# EAGLE board spokepov (EAGLE 6.6.0)
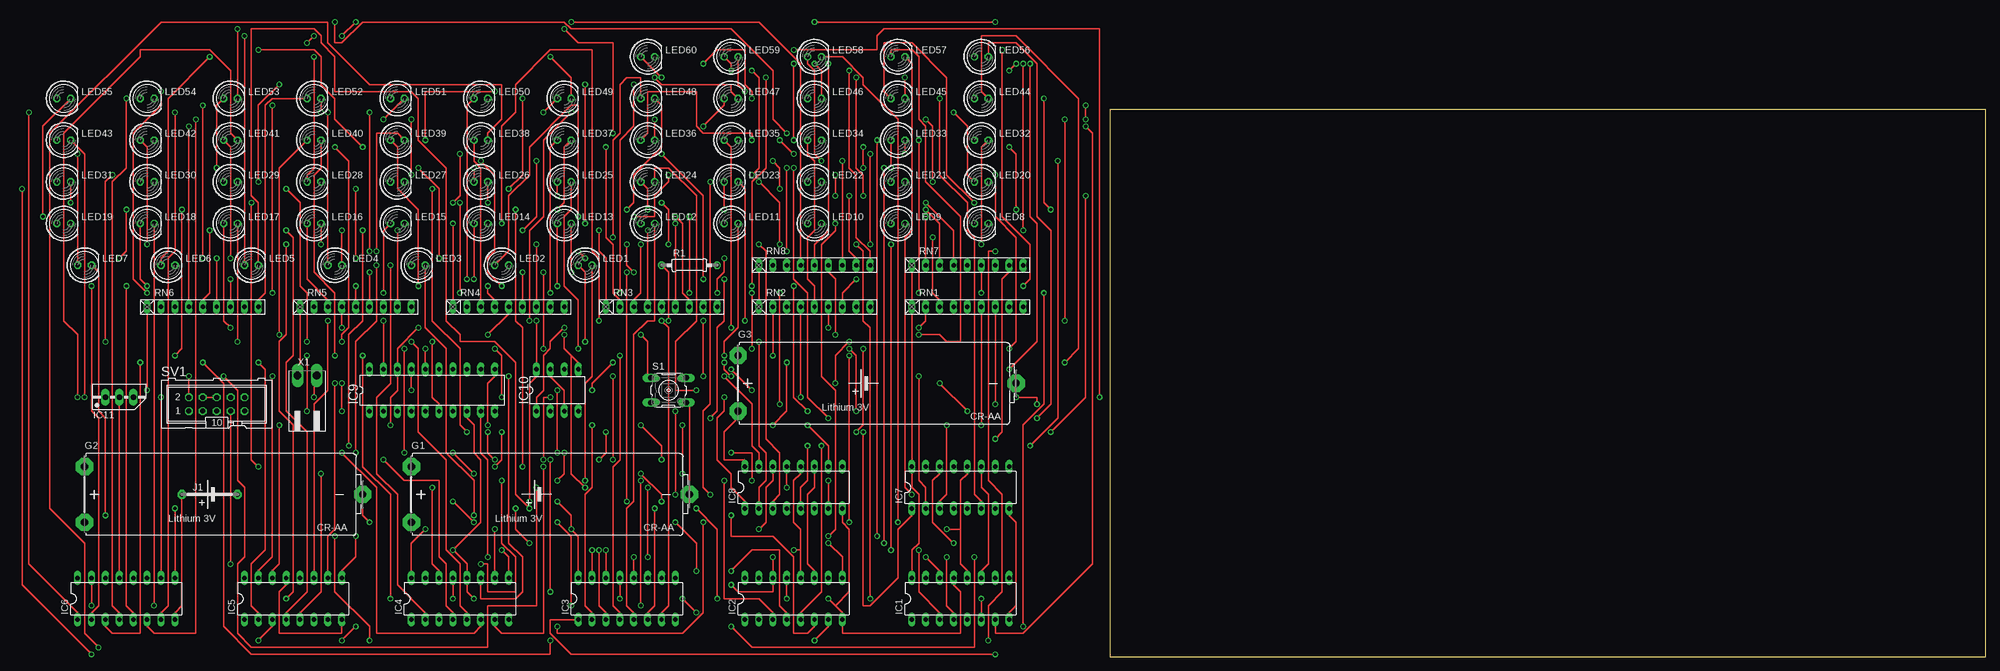
[diagram p1: board, top side]
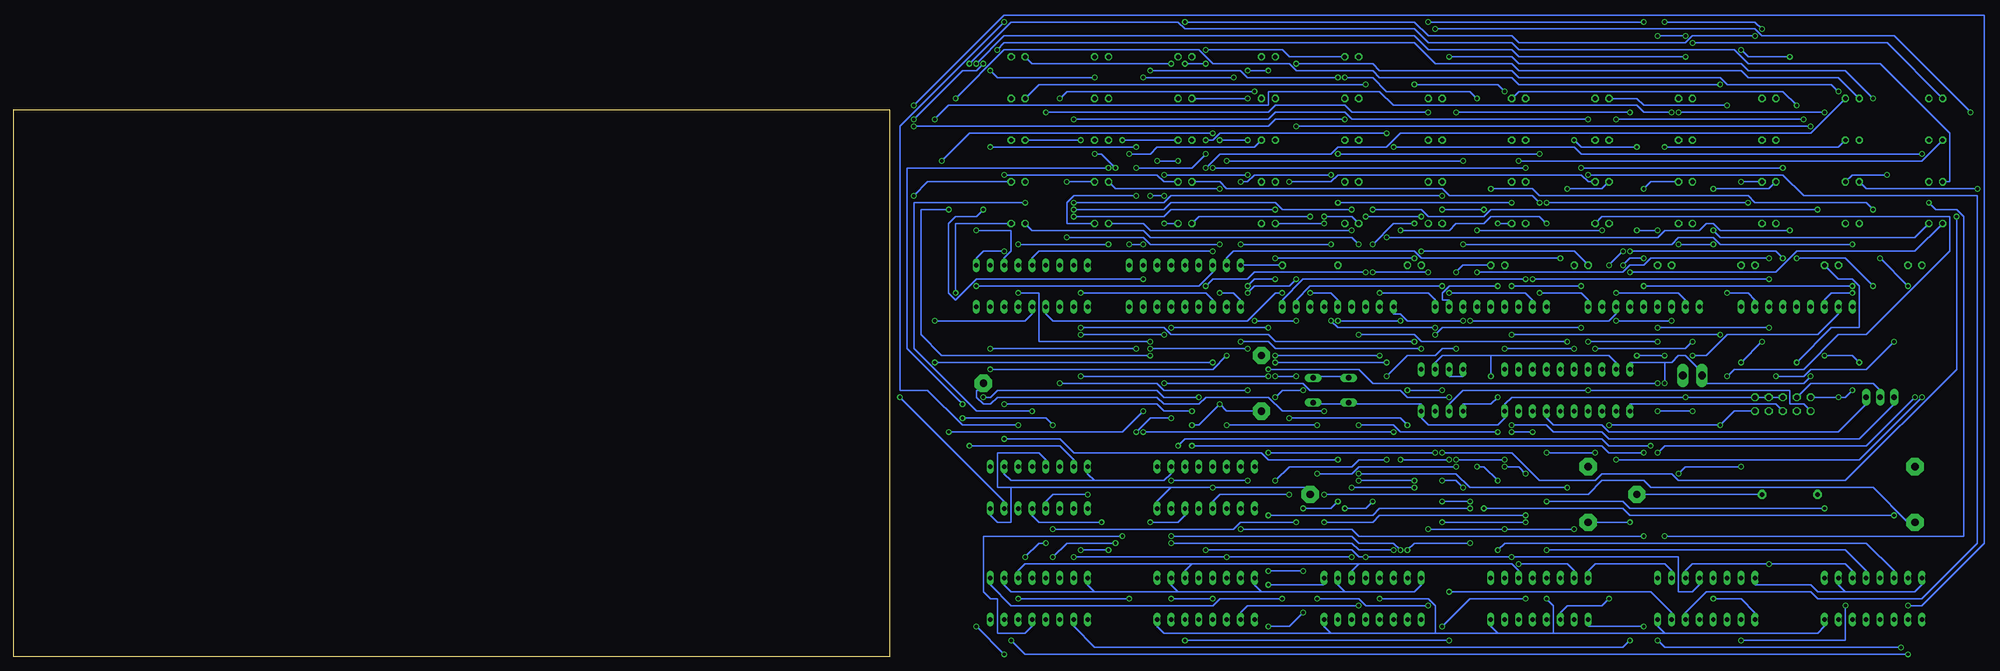
[diagram p2: board, bottom side, seen from below]

Size 160 x 100 mm. Coordinates in mm from the lower left corner, seen from the top.
Outline: 0,0 160,0 160,100 0,100 0,0
Copper layers (1*16): Top 0.035mm / dielectric 1.5mm / Bottom 0.035mm
Design rules "10mils": minimum track width 10mil, minimum drill 24mil, track to track 10mil, track to pad 10mil, pad to pad 10mil, via to via 10mil, smd to smd 10mil, copper to edge 40mil, drill to drill 10mil, minimum pad ring 10mil, minimum via ring 8mil, stop-mask expansion 0mil, vias tented up to drill 0mil, thermal gap 10mil

## Footprints (pad centres in the part's own frame; a part is rotated, then mirrored left to right if it is on the bottom)
CRAA = drill 1.321 pad 3.15 octagon: + -25.4,-5.08; +@1 -25.4,5.08; - 25.4,0
DIL16 = drill 0.813 long: 1 -8.89,-3.81; 2 -6.35,-3.81; 3 -3.81,-3.81; 4 -1.27,-3.81; 5 1.27,-3.81; 6 3.81,-3.81; 7 6.35,-3.81; 8 8.89,-3.81; 9 8.89,3.81; 10 6.35,3.81; 11 3.81,3.81; 12 1.27,3.81; 13 -1.27,3.81; 14 -3.81,3.81; 15 -6.35,3.81; 16 -8.89,3.81
DIL20 = drill 0.813 long: 1 -11.43,-3.81; 2 -8.89,-3.81; 3 -6.35,-3.81; 4 -3.81,-3.81; 5 -1.27,-3.81; 6 1.27,-3.81; 7 3.81,-3.81; 8 6.35,-3.81; 9 8.89,-3.81; 10 11.43,-3.81; 11 11.43,3.81; 12 8.89,3.81; 13 6.35,3.81; 14 3.81,3.81; 15 1.27,3.81; 16 -1.27,3.81; 17 -3.81,3.81; 18 -6.35,3.81; 19 -8.89,3.81; 20 -11.43,3.81
DIL8 = drill 0.813 long: 1 -3.81,-3.81; 2 -1.27,-3.81; 3 1.27,-3.81; 4 3.81,-3.81; 5 3.81,3.81; 6 1.27,3.81; 7 -1.27,3.81; 8 -3.81,3.81
78MXXS = drill 1.016 long: GND 0,-2.54; IN -2.54,-2.54; OUT 2.54,-2.54
10 = drill 0.813 pad 1.6 octagon: 1 -5.08,0; 2 5.08,0
LED5MM = drill 0.813 octagon: A -1.27,0; K 1.27,0
0207/10 = drill 0.813 octagon: 1 -5.08,0; 2 5.08,0
RN-9 = drill 0.813 long: 1 -10.16,0; 2 -7.62,0; 3 -5.08,0; 4 -2.54,0; 5 0,0; 6 2.54,0; 7 5.08,0; 8 7.62,0; 9 10.16,0
B3F-10XX = drill 1.016 long: 1 -3.251,2.261; 2 3.251,2.261; 3 -3.251,-2.261; 4 3.251,-2.261
ML10 = drill 0.914 octagon: 1 -5.08,-1.27; 2 -5.08,1.27; 3 -2.54,-1.27; 4 -2.54,1.27; 5 0,-1.27; 6 0,1.27; 7 2.54,-1.27; 8 2.54,1.27; 9 5.08,-1.27; 10 5.08,1.27
90-2 = drill 1.422 long: 1 -1.75,5.25; 2 1.75,5.25

## Placement (x,y rotation side)
G1  CR-AA  [CRAA]  -102.24,29.68 0 top  (outside the outline)
G2  CR-AA  [CRAA]  -161.93,29.68 0 top  (outside the outline)
G3  CR-AA  [CRAA]  -42.55,50 0 top  (outside the outline)
IC1  74LS595N  [DIL16]  -27.31,10.63 0 top  (outside the outline)
IC2  74LS595N  [DIL16]  -57.79,10.63 0 top  (outside the outline)
IC3  74LS595N  [DIL16]  -88.27,10.63 0 top  (outside the outline)
IC4  74LS595N  [DIL16]  -118.75,10.63 0 top  (outside the outline)
IC5  74LS595N  [DIL16]  -149.23,10.63 0 top  (outside the outline)
IC6  74LS595N  [DIL16]  -179.71,10.63 0 top  (outside the outline)
IC7  74LS595N  [DIL16]  -27.31,30.95 0 top  (outside the outline)
IC8  74LS595N  [DIL16]  -57.79,30.95 0 top  (outside the outline)
IC9  ATTINY2313-20P  [DIL20]  -123.83,48.73 0 top  (outside the outline)
IC10  25LC080P  [DIL8]  -100.97,48.73 0 top  (outside the outline)
IC11  DN6852  [78MXXS]  -180.98,50 0 top  (outside the outline)
J1  J10MM  [10]  -164.47,29.68 0 top  (outside the outline)
LED1  [LED5MM]  -95.89,71.59 0 top  (outside the outline)
LED2  [LED5MM]  -111.13,71.59 0 top  (outside the outline)
LED3  [LED5MM]  -126.37,71.59 0 top  (outside the outline)
LED4  [LED5MM]  -141.61,71.59 0 top  (outside the outline)
LED5  [LED5MM]  -156.85,71.59 0 top  (outside the outline)
LED6  [LED5MM]  -172.09,71.59 0 top  (outside the outline)
LED7  [LED5MM]  -187.33,71.59 0 top  (outside the outline)
LED8  [LED5MM]  -23.5,79.21 0 top  (outside the outline)
LED9  [LED5MM]  -38.74,79.21 0 top  (outside the outline)
LED10  [LED5MM]  -53.98,79.21 0 top  (outside the outline)
LED11  [LED5MM]  -69.22,79.21 0 top  (outside the outline)
LED12  [LED5MM]  -84.46,79.21 0 top  (outside the outline)
LED13  [LED5MM]  -99.7,79.21 0 top  (outside the outline)
LED14  [LED5MM]  -114.94,79.21 0 top  (outside the outline)
LED15  [LED5MM]  -130.18,79.21 0 top  (outside the outline)
LED16  [LED5MM]  -145.42,79.21 0 top  (outside the outline)
LED17  [LED5MM]  -160.66,79.21 0 top  (outside the outline)
LED18  [LED5MM]  -175.9,79.21 0 top  (outside the outline)
LED19  [LED5MM]  -191.14,79.21 0 top  (outside the outline)
LED20  [LED5MM]  -23.5,86.83 0 top  (outside the outline)
LED21  [LED5MM]  -38.74,86.83 0 top  (outside the outline)
LED22  [LED5MM]  -53.98,86.83 0 top  (outside the outline)
LED23  [LED5MM]  -69.22,86.83 0 top  (outside the outline)
LED24  [LED5MM]  -84.46,86.83 0 top  (outside the outline)
LED25  [LED5MM]  -99.7,86.83 0 top  (outside the outline)
LED26  [LED5MM]  -114.94,86.83 0 top  (outside the outline)
LED27  [LED5MM]  -130.18,86.83 0 top  (outside the outline)
LED28  [LED5MM]  -145.42,86.83 0 top  (outside the outline)
LED29  [LED5MM]  -160.66,86.83 0 top  (outside the outline)
LED30  [LED5MM]  -175.9,86.83 0 top  (outside the outline)
LED31  [LED5MM]  -191.14,86.83 0 top  (outside the outline)
LED32  [LED5MM]  -23.5,94.45 0 top  (outside the outline)
LED33  [LED5MM]  -38.74,94.45 0 top  (outside the outline)
LED34  [LED5MM]  -53.98,94.45 0 top  (outside the outline)
LED35  [LED5MM]  -69.22,94.45 0 top  (outside the outline)
LED36  [LED5MM]  -84.46,94.45 0 top  (outside the outline)
LED37  [LED5MM]  -99.7,94.45 0 top  (outside the outline)
LED38  [LED5MM]  -114.94,94.45 0 top  (outside the outline)
LED39  [LED5MM]  -130.18,94.45 0 top  (outside the outline)
LED40  [LED5MM]  -145.42,94.45 0 top  (outside the outline)
LED41  [LED5MM]  -160.66,94.45 0 top  (outside the outline)
LED42  [LED5MM]  -175.9,94.45 0 top  (outside the outline)
LED43  [LED5MM]  -191.14,94.45 0 top  (outside the outline)
LED44  [LED5MM]  -23.5,102.07 0 top  (outside the outline)
LED45  [LED5MM]  -38.74,102.07 0 top  (outside the outline)
LED46  [LED5MM]  -53.98,102.07 0 top  (outside the outline)
LED47  [LED5MM]  -69.22,102.07 0 top  (outside the outline)
LED48  [LED5MM]  -84.46,102.07 0 top  (outside the outline)
LED49  [LED5MM]  -99.7,102.07 0 top  (outside the outline)
LED50  [LED5MM]  -114.94,102.07 0 top  (outside the outline)
LED51  [LED5MM]  -130.18,102.07 0 top  (outside the outline)
LED52  [LED5MM]  -145.42,102.07 0 top  (outside the outline)
LED53  [LED5MM]  -160.66,102.07 0 top  (outside the outline)
LED54  [LED5MM]  -175.9,102.07 0 top  (outside the outline)
LED55  [LED5MM]  -191.14,102.07 0 top  (outside the outline)
LED56  [LED5MM]  -23.5,109.69 0 top  (outside the outline)
LED57  [LED5MM]  -38.74,109.69 0 top  (outside the outline)
LED58  [LED5MM]  -53.98,109.69 0 top  (outside the outline)
LED59  [LED5MM]  -69.22,109.69 0 top  (outside the outline)
LED60  [LED5MM]  -84.46,109.69 0 top  (outside the outline)
R1  [0207/10]  -76.84,71.59 0 top  (outside the outline)
RN1  [RN-9]  -26.04,63.97 0 top  (outside the outline)
RN2  [RN-9]  -53.98,63.97 0 top  (outside the outline)
RN3  [RN-9]  -81.92,63.97 0 top  (outside the outline)
RN4  [RN-9]  -109.86,63.97 0 top  (outside the outline)
RN5  [RN-9]  -137.8,63.97 0 top  (outside the outline)
RN6  [RN-9]  -165.74,63.97 0 top  (outside the outline)
RN7  [RN-9]  -26.04,71.59 0 top  (outside the outline)
RN8  [RN-9]  -53.98,71.59 0 top  (outside the outline)
S1  [B3F-10XX]  -80.65,48.73 0 top  (outside the outline)
SV1  [ML10]  -163.2,46.19 0 top  (outside the outline)
X1  [90-2]  -146.69,46.19 0 top  (outside the outline)

## Tracks (layer width: path | path; a pad name or v marks a point on that pad's centre or on a via)
B_SELECT  (via drill 0.61)
  Top 0.254: -56.52,19.52 -56.52,23.33 -57.79,24.6 -57.79,32.22 -56.52,33.49 IC8.12 | -56.52,19.52 IC2.12 | v-87,18.25 IC3.12 | IC9.9 -114.94,37.3 -113.67,36.03 v-113.67,18.25 | -56.52,19.52 v-57.79,19.52
  Bottom 0.254: IC5.12 -147.96,13.17 -146.69,11.9 -144.15,11.9 -144.15,18.25 v-113.67,18.25 v-87,18.25 -85.73,18.25 -84.46,19.52 v-57.79,19.52
BUTTON_IN  (via drill 0.61)
  Top 0.254: v-123.83,57.62 -123.83,47.46 -122.56,46.19 IC9.6 | v-85.73,58.89 -84.46,57.62 -84.46,51.27 S1.1
  Bottom 0.254: v-123.83,57.62 -97.16,57.62 -95.89,58.89 v-85.73,58.89 | S1.2 -78.11,51.27 -83.19,51.27 S1.1
EE_CS  (via drill 0.61)
  Top 0.254: v-125.1,56.35 IC9.16 | v-112.4,56.35 -111.13,55.08 v-111.13,47.46 | R1.1 -80.65,70.32 v-80.65,61.43 | v-99.7,60.16 -102.24,57.62 -102.24,56.35 -103.51,55.08 -103.51,48.73 -104.78,47.46 IC10.1
  Bottom 0.254: v-112.4,56.35 v-125.1,56.35 | v-111.13,47.46 -109.86,46.19 -104.78,46.19 IC10.1 | v-80.65,61.43 -81.92,60.16 v-99.7,60.16
F_SELECT  (via drill 0.61)
  Top 0.254: -27.31,23.33 -27.31,32.22 -26.04,33.49 IC7.12 | -27.31,23.33 -27.31,16.98 -26.04,15.71 IC1.12 | IC9.8 -117.48,43.65 -116.21,42.38 -116.21,37.3 -114.94,36.03 -114.94,24.6 v-120.02,19.52 -117.48,16.98 IC4.12 -117.48,11.9 v-116.21,10.63 | -27.31,23.33 v-29.85,23.33 | v-74.3,24.6 -74.3,8.09 -78.11,4.28 -100.97,4.28 v-100.97,5.55
  Bottom 0.254: v-120.02,19.52 -174.63,19.52 -178.44,15.71 IC6.12 | v-29.85,23.33 -62.87,23.33 -64.14,24.6 v-74.3,24.6 | v-100.97,5.55 -106.05,10.63 v-116.21,10.63
GND  (via drill 0.61)
  Top 0.254: J1.1 -169.55,9.36 -170.82,8.09 IC6.8 | IC5.13 -150.5,13.17 -151.77,11.9 -151.77,4.28 -140.34,4.28 IC5.8 | v-120.02,10.63 IC4.13 | v-89.54,10.63 IC3.13 | v-59.06,10.63 IC2.13 | -50.17,9.36 -48.9,8.09 IC2.8 -48.9,4.28 -27.31,4.28 -27.31,11.9 -28.58,13.17 IC1.13 | -50.17,9.36 v-51.44,10.63 | SV1.6 SV1.4 | v-145.42,47.46 -145.42,50 X1.2 | IC11.GND IC6.13 | IC1.8 -18.42,8.09 -17.15,9.36 -17.15,24.6 -18.42,25.87 IC7.8 | v-59.06,30.95 IC8.13 | G1.- -76.84,46.19 S1.4 | -50.17,9.36 -47.63,11.9 -47.63,23.33 -48.9,24.6 IC8.8
  Bottom 0.254: -141.61,4.28 -140.34,5.55 IC5.8 | -141.61,4.28 -169.55,4.28 -170.82,5.55 IC6.8 | -111.13,4.28 -109.86,5.55 IC4.8 | -121.29,4.28 -141.61,4.28 | -111.13,4.28 -121.29,4.28 | -80.65,4.28 -79.38,5.55 IC3.8 | -99.7,4.28 -111.13,4.28 | -80.65,4.28 -99.7,4.28 | -80.65,4.28 -50.17,4.28 -48.9,5.55 IC2.8 | v-120.02,10.63 -121.29,9.36 -121.29,4.28 | v-89.54,10.63 -98.43,10.63 -99.7,9.36 -99.7,4.28 | v-51.44,10.63 v-59.06,10.63 | SV1.6 SV1.8 SV1.10 v-145.42,47.46 -113.67,47.46 -112.4,46.19 IC9.10 -112.4,43.65 -111.13,42.38 -98.43,42.38 -97.16,43.65 IC10.4 -97.16,46.19 -84.46,46.19 S1.3 -83.19,46.19 -78.11,46.19 S1.4 | SV1.4 -168.28,50 -179.71,50 -180.98,48.73 IC11.GND | G1.- -76.84,30.95 v-59.06,30.95 -51.44,30.95 | -51.44,30.95 -48.9,28.41 IC8.8 | -22.23,30.95 -51.44,30.95 | -22.23,30.95 -19.69,30.95 -19.69,37.3 -27.31,37.3 -28.58,36.03 IC7.13 | -22.23,30.95 -22.23,24.6 -19.69,24.6 -18.42,25.87 IC7.8
N$1  (via drill 0.61)
  Top 0.254: v-14.61,38.57 -9.53,43.65 v-9.53,90.64 | v-59.06,95.72 -61.6,98.26 -61.6,107.15 -69.22,114.77 -98.43,114.77 -99.7,116.04 -136.53,116.04 -140.34,112.23 -141.61,112.23 v-141.61,116.04 | v-159.39,114.77 LED53.K
  Bottom 0.254: v-14.61,38.57 -31.12,38.57 -33.66,36.03 IC7.15 | v-9.53,90.64 -14.61,95.72 v-59.06,95.72 | v-141.61,116.04 -158.12,116.04 v-159.39,114.77
N$2  (via drill 0.61)
  Top 0.254: v-45.09,41.11 -45.09,9.36 -43.82,9.36 -38.74,14.44 -38.74,23.33 -36.2,25.87 IC7.1 | v-51.44,43.65 -55.25,47.46 -55.25,66.51 -57.79,69.05 v-57.79,89.37
  Bottom 0.254: v-45.09,41.11 -47.63,43.65 v-51.44,43.65 | v-57.79,89.37 -60.33,91.91 -80.65,91.91 -81.92,93.18 -90.81,93.18 -93.35,95.72 -168.28,95.72 LED54.K
N$3  (via drill 0.61)
  Top 0.254: IC7.2 -33.66,30.95 -34.93,32.22 v-34.93,51.27 | v-69.22,51.27 -70.49,52.54 v-70.49,53.81 | v-90.81,53.81 -94.62,50 v-94.62,48.73 | v-100.97,48.73 v-100.97,37.3 | v-194.95,80.48 -194.95,96.99 LED55.K
  Bottom 0.254: v-34.93,51.27 v-69.22,51.27 | v-70.49,53.81 v-90.81,53.81 | v-94.62,48.73 v-100.97,48.73 | v-100.97,37.3 -113.67,37.3 -118.75,32.22 -128.91,32.22 -130.18,33.49 -142.88,33.49 -144.15,32.22 -174.63,32.22 -194.95,52.54 v-194.95,80.48
N$4  (via drill 0.61)
  Top 0.254: v-29.85,42.38 -29.85,29.68 -31.12,28.41 IC7.3 | v-13.34,43.65 -10.8,46.19 -10.8,77.94 -13.34,80.48 -13.34,108.42 -17.15,112.23 -22.23,112.23 LED56.K
  Bottom 0.254: v-29.85,42.38 -28.58,43.65 v-13.34,43.65
N$5  (via drill 0.61)
  Top 0.254: v-36.2,29.68 -37.47,30.95 -37.47,76.67 -36.2,77.94 -36.2,108.42 LED57.K
  Bottom 0.254: v-36.2,29.68 -29.85,29.68 -28.58,28.41 IC7.4
N$6  (via drill 0.61)
  Top 0.254: v-38.74,24.6 -38.74,98.26 -45.09,104.61 -45.09,105.88 -48.9,109.69 LED58.K
  Bottom 0.254: v-38.74,24.6 -27.31,24.6 -26.04,25.87 IC7.5
N$7  (via drill 0.61)
  Top 0.254: LED1.K -94.62,51.27 -95.89,50 v-95.89,32.22 | v-85.73,32.22 v-85.73,9.36
  Bottom 0.254: v-95.89,32.22 v-85.73,32.22 | v-85.73,9.36 -65.41,9.36 -64.14,8.09 IC2.2
N$8  (via drill 0.61)
  Top 0.254: v-70.49,32.22 -70.49,10.63 -64.14,10.63 -61.6,8.09 IC2.3 | v-90.81,51.27 v-90.81,36.03 | v-103.51,70.32 v-103.51,56.35
  Bottom 0.254: v-70.49,32.22 -73.03,34.76 -84.46,34.76 -85.73,36.03 v-90.81,36.03 | v-90.81,51.27 -94.62,55.08 -99.7,55.08 -100.97,56.35 v-103.51,56.35 | v-103.51,70.32 -104.78,71.59 LED2.K
N$9  (via drill 0.61)
  Top 0.254: LED3.K -125.1,60.16 -121.29,56.35 -121.29,37.3 -116.21,32.22 v-116.21,25.87 | v-79.38,24.6 -75.57,20.79 v-75.57,15.71 | v-69.22,15.71 -65.41,19.52 -60.33,19.52 -60.33,9.36 -59.06,8.09 IC2.4
  Bottom 0.254: v-116.21,25.87 -89.54,25.87 -88.27,24.6 v-79.38,24.6 | v-69.22,15.71 v-75.57,15.71
N$10  (via drill 0.61)
  Top 0.254: v-52.71,38.57 -52.71,11.9 -56.52,8.09 IC2.5 | v-139.07,38.57 -139.07,58.89 -136.53,61.43 v-136.53,77.94 | v-140.34,77.94 LED4.K
  Bottom 0.254: v-52.71,38.57 -53.98,39.84 -130.18,39.84 -131.45,38.57 v-139.07,38.57 | v-136.53,77.94 v-140.34,77.94
N$11  (via drill 0.61)
  Top 0.254: v-69.22,25.87 -69.22,22.06 -61.6,22.06 -57.79,18.25 -57.79,4.28 -55.25,4.28 -53.98,5.55 IC2.6 | v-106.05,27.14 -108.59,29.68 -108.59,53.81 -112.4,57.62 -118.75,57.62 -118.75,58.89 -121.29,61.43 -121.29,89.37 -126.37,94.45 -126.37,102.07 -127.64,103.34 -141.61,103.34 -141.61,109.69 -144.15,112.23 -144.15,113.5 -145.42,114.77 -156.85,114.77 -156.85,84.29 -155.58,83.02 LED5.K
  Bottom 0.254: v-69.22,25.87 -88.27,25.87 -89.54,27.14 v-106.05,27.14
N$12  (via drill 0.61)
  Top 0.254: v-165.74,53.81 -161.93,50 -161.93,5.55 -156.85,0.47 -102.24,0.47 v-102.24,3.01 | v-53.98,3.01 -51.44,5.55 IC2.7
  Bottom 0.254: LED6.K -173.36,69.05 -175.9,69.05 -177.17,67.78 -177.17,60.16 -172.09,60.16 v-165.74,53.81 | v-53.98,3.01 v-102.24,3.01
N$13  (via drill 0.61)
  Top 0.254: LED1.A -95.89,70.32 v-95.89,57.62 | v-34.93,60.16 -33.66,61.43 RN1.2
  Bottom 0.254: v-95.89,57.62 -70.49,57.62 -69.22,58.89 -51.44,58.89 -50.17,60.16 v-34.93,60.16
N$14  (via drill 0.61)
  Top 0.254: LED2.A -109.86,74.13 -109.86,84.29 -106.05,88.1 -106.05,93.18 -98.43,100.8 -97.16,100.8 v-97.16,80.48 | v-87,80.48 -83.19,80.48 -83.19,84.29 -80.65,86.83 v-80.65,88.1 | v-64.14,86.83 -60.33,83.02 v-60.33,75.4 | v-32.39,76.67 -32.39,66.51 -31.12,65.24 RN1.3
  Bottom 0.254: v-87,80.48 v-97.16,80.48 | v-80.65,88.1 -66.68,88.1 -65.41,86.83 v-64.14,86.83 | v-60.33,75.4 -47.63,75.4 -46.36,76.67 v-32.39,76.67
N$15  (via drill 0.61)
  Top 0.254: v-71.76,66.51 -71.76,69.05 -70.49,70.32 v-70.49,72.86 | v-95.89,72.86 v-97.16,74.13
  Bottom 0.254: v-71.76,66.51 -70.49,66.51 -65.41,61.43 -29.85,61.43 -28.58,62.7 RN1.4 | v-70.49,72.86 v-95.89,72.86 | v-97.16,74.13 -125.1,74.13 LED3.A
N$16  (via drill 0.61)
  Top 0.254: v-8.26,98.26 v-8.26,61.43 | v-142.88,99.53 LED4.A
  Bottom 0.254: v-8.26,61.43 -24.77,61.43 -26.04,62.7 RN1.5 | v-8.26,98.26 -10.8,100.8 -69.22,100.8 -69.22,103.34 -89.54,103.34 -92.08,100.8 -136.53,100.8 -137.8,99.53 v-142.88,99.53
N$17  (via drill 0.61)
  Top 0.254: v-158.12,113.5 LED5.A | v-53.98,116.04 v-20.96,116.04 | v-23.5,42.38 RN1.6
  Bottom 0.254: v-158.12,113.5 -146.69,113.5 -145.42,112.23 -114.94,112.23 -113.67,113.5 -98.43,113.5 -95.89,116.04 v-53.98,116.04 | v-20.96,116.04 -1.91,96.99 -1.91,48.73 -6.99,48.73 -13.34,42.38 v-23.5,42.38
N$18  (via drill 0.61)
  Top 0.254: v-20.96,46.19 RN1.7 | v-55.25,44.92 -57.79,47.46 v-57.79,67.78 | v-87,70.32 -88.27,71.59 v-88.27,75.4 | v-95.89,79.21 v-95.89,104.61 | v-112.4,103.34 -125.1,103.34 v-125.1,94.45 | v-136.53,93.18 -141.61,98.26 -141.61,102.07 -144.15,104.61 -144.15,109.69 -145.42,110.96 v-155.58,110.96 | v-164.47,109.69 -172.09,102.07 -172.09,74.13 -173.36,72.86 LED6.A
  Bottom 0.254: v-20.96,46.19 -48.9,46.19 -50.17,44.92 v-55.25,44.92 | v-57.79,67.78 -59.06,69.05 -65.41,69.05 -66.68,70.32 v-87,70.32 | v-88.27,75.4 -92.08,79.21 v-95.89,79.21 | v-95.89,104.61 -111.13,104.61 v-112.4,103.34 | v-125.1,94.45 -126.37,93.18 v-136.53,93.18 | v-155.58,110.96 -156.85,109.69 v-164.47,109.69
N$19  (via drill 0.61)
  Top 0.254: v-92.08,93.18 -92.08,76.67 -90.81,75.4 -90.81,66.51 -89.54,65.24 RN3.2 | v-188.6,91.91 LED7.A
  Bottom 0.254: v-92.08,93.18 -125.1,93.18 -126.37,91.91 v-188.6,91.91
N$20  (via drill 0.61)
  Top 0.254: v-85.73,75.4 -85.73,66.51 -87,65.24 RN3.3
  Bottom 0.254: v-85.73,75.4 -84.46,76.67 -47.63,76.67 -46.36,77.94 -26.04,77.94 LED8.A
N$21  (via drill 0.61)
  Top 0.254: v-84.46,77.94 RN3.4
  Bottom 0.254: v-84.46,77.94 -47.63,77.94 -46.36,79.21 LED9.A
N$22  (via drill 0.61)
  Top 0.254: v-76.84,80.48 v-76.84,66.51
  Bottom 0.254: v-76.84,66.51 -80.65,66.51 -81.92,65.24 RN3.5 | v-76.84,80.48 -56.52,80.48 LED10.A
N$23  (via drill 0.61)
  Top 0.254: v-79.38,79.21 RN3.6
  Bottom 0.254: v-79.38,79.21 LED11.A
N$24  (via drill 0.61)
  Top 0.254: v-79.38,80.48 -78.11,79.21 -78.11,66.51 -76.84,65.24 RN3.7
  Bottom 0.254: LED12.A -84.46,80.48 v-79.38,80.48
N$25  (via drill 0.61)
  Top 0.254: v-100.97,67.78 LED13.A
  Bottom 0.254: v-100.97,67.78 -76.84,67.78 -74.3,65.24 RN3.8
N$26  (via drill 0.61)
  Top 0.254: v-116.21,69.05 LED14.A
  Bottom 0.254: v-116.21,69.05 -75.57,69.05 -71.76,65.24 RN3.9
N$27  (via drill 0.61)
  Top 0.254: v-132.72,66.51 -132.72,77.94 LED15.A
  Bottom 0.254: v-132.72,66.51 -144.15,66.51 -145.42,65.24 RN5.2
N$28
  Top 0.254: LED16.A -146.69,69.05 -142.88,65.24 RN5.3
N$29  (via drill 0.61)
  Top 0.254: RN5.4 v-140.34,60.16 | v-160.66,60.16 -161.93,61.43 LED17.A
  Bottom 0.254: v-140.34,60.16 v-160.66,60.16
N$30  (via drill 0.61)
  Top 0.254: v-137.8,67.78 RN5.5 | v-175.9,67.78 -177.17,69.05 LED18.A
  Bottom 0.254: v-137.8,67.78 v-175.9,67.78
N$31  (via drill 0.61)
  Top 0.254: v-135.26,70.32 RN5.6
  Bottom 0.254: v-135.26,70.32 -161.93,70.32 -165.74,74.13 -187.33,74.13 LED19.A
N$32  (via drill 0.61)
  Top 0.254: v-106.05,61.43 -106.05,77.94 -103.51,80.48 -103.51,94.45 v-98.43,99.53 | v-28.58,99.53 -26.04,96.99 -26.04,88.1 LED20.A
  Bottom 0.254: v-106.05,61.43 -131.45,61.43 -132.72,62.7 RN5.7 | v-98.43,99.53 -84.46,99.53 -83.19,100.8 -70.49,100.8 -69.22,99.53 v-28.58,99.53
N$33  (via drill 0.61)
  Top 0.254: v-130.18,77.94 RN5.8 | v-107.32,77.94 -104.78,80.48 v-104.78,90.64 | v-61.6,90.64 -60.33,89.37 v-60.33,85.56
  Bottom 0.254: v-107.32,77.94 v-130.18,77.94 | v-104.78,90.64 v-61.6,90.64 | v-60.33,85.56 -41.28,85.56 LED21.A
N$34  (via drill 0.61)
  Top 0.254: v-118.75,83.02 v-118.75,66.51
  Bottom 0.254: v-118.75,66.51 -126.37,66.51 -127.64,65.24 RN5.9 | v-118.75,83.02 -117.48,84.29 -102.24,84.29 -100.97,85.56 -61.6,85.56 -60.33,86.83 LED22.A
N$35  (via drill 0.61)
  Top 0.254: v-70.49,81.75 LED23.A | v-33.66,80.48 RN7.2
  Bottom 0.254: v-70.49,81.75 -51.44,81.75 -50.17,80.48 v-33.66,80.48
N$36  (via drill 0.61)
  Top 0.254: LED24.A -84.46,85.56 v-84.46,81.75 | v-33.66,81.75 -31.12,79.21 RN7.3
  Bottom 0.254: v-84.46,81.75 -71.76,81.75 -70.49,83.02 -51.44,83.02 -50.17,81.75 v-33.66,81.75
N$37  (via drill 0.61)
  Top 0.254: LED25.A v-100.97,84.29 | v-33.66,83.02 -28.58,77.94 RN7.4
  Bottom 0.254: v-100.97,84.29 -51.44,84.29 -50.17,83.02 v-33.66,83.02
N$38  (via drill 0.61)
  Top 0.254: v-116.21,89.37 LED26.A | v-59.06,74.13 v-59.06,89.37
  Bottom 0.254: v-59.06,89.37 v-116.21,89.37 | v-59.06,74.13 -27.31,74.13 -26.04,72.86 RN7.5
N$39  (via drill 0.61)
  Top 0.254: v-23.5,66.51 RN7.6 | v-47.63,57.62 -50.17,55.08 v-50.17,50 | v-102.24,47.46 -103.51,47.46 v-103.51,36.03 | v-112.4,36.03 -113.67,37.3 v-113.67,41.11 | v-117.48,41.11 -118.75,42.38 -118.75,56.35 -123.83,61.43 v-123.83,85.56
  Bottom 0.254: v-23.5,66.51 -27.31,66.51 -27.31,57.62 v-47.63,57.62 | v-50.17,50 -75.57,50 -76.84,48.73 -93.35,48.73 -94.62,47.46 v-102.24,47.46 | v-103.51,36.03 v-112.4,36.03 | v-113.67,41.11 v-117.48,41.11 | v-123.83,85.56 -130.18,85.56 LED27.A
N$40  (via drill 0.61)
  Top 0.254: v-15.88,108.42 v-15.88,77.94 | v-145.42,109.69 -145.42,89.37 -146.69,88.1 LED28.A
  Bottom 0.254: v-15.88,77.94 -22.23,77.94 -22.23,74.13 -20.96,72.86 RN7.7 | v-15.88,108.42 -20.96,113.5 -95.89,113.5 -98.43,110.96 -113.67,110.96 -114.94,109.69 v-145.42,109.69
N$41  (via drill 0.61)
  Top 0.254: v-150.5,85.56 -147.96,83.02 -147.96,67.78 -146.69,66.51 v-146.69,57.62 | v-128.91,37.3 v-128.91,56.35 | v-116.21,33.49 v-120.02,37.3 | v-112.4,34.76 -111.13,36.03 v-111.13,41.11 | v-85.73,42.38 -81.92,38.57 v-81.92,36.03 | v-20.96,39.84 -19.69,41.11 -19.69,69.05 -18.42,70.32 RN7.8
  Bottom 0.254: LED29.A -160.66,85.56 v-150.5,85.56 | v-146.69,57.62 -145.42,56.35 v-128.91,56.35 | v-120.02,37.3 v-128.91,37.3 | v-116.21,33.49 -114.94,34.76 v-112.4,34.76 | v-111.13,41.11 -93.35,41.11 -92.08,42.38 v-85.73,42.38 | v-81.92,36.03 -69.22,36.03 -67.95,37.3 -33.66,37.3 -31.12,39.84 v-20.96,39.84
N$42  (via drill 0.61)
  Top 0.254: v-20.96,74.13 -22.23,74.13 -22.23,32.22 -19.69,29.68 -19.69,11.9 -22.23,9.36 v-22.23,3.01 | v-186.06,0.47 -198.76,13.17 v-198.76,85.56
  Bottom 0.254: v-20.96,74.13 -17.15,74.13 -15.88,72.86 RN7.9 | v-22.23,3.01 -24.77,0.47 v-186.06,0.47 | v-198.76,85.56 -178.44,85.56 LED30.A
N$43  (via drill 0.61)
  Top 0.254: v-189.87,83.02 LED31.K | v-141.61,22.06 -141.61,11.9 -135.26,5.55 v-135.26,3.01
  Bottom 0.254: v-189.87,83.02 -191.14,81.75 -194.95,81.75 -196.22,80.48 -196.22,22.06 v-141.61,22.06 | v-135.26,3.01 -133.99,1.74 -37.47,1.74 -33.66,5.55 IC1.2
N$44  (via drill 0.61)
  Top 0.254: v-34.93,19.52 -34.93,11.9 -31.12,8.09 IC1.3 | v-40.01,19.52 v-40.01,75.4 | v-23.5,75.4 -23.5,93.18 LED32.K
  Bottom 0.254: v-34.93,19.52 v-40.01,19.52 | v-40.01,75.4 v-23.5,75.4
N$45  (via drill 0.61)
  Top 0.254: v-29.85,18.25 -29.85,9.36 -28.58,8.09 IC1.4 | v-41.28,20.79 v-41.28,89.37 | v-37.47,91.91 LED33.K
  Bottom 0.254: v-29.85,18.25 -32.39,20.79 v-41.28,20.79 | v-41.28,89.37 -38.74,91.91 v-37.47,91.91
N$46  (via drill 0.61)
  Top 0.254: v-42.55,22.06 v-42.55,94.45
  Bottom 0.254: v-42.55,22.06 -17.15,22.06 -17.15,11.9 -18.42,10.63 -19.69,10.63 -19.69,4.28 -24.77,4.28 -26.04,5.55 IC1.5 | v-42.55,94.45 LED34.K
N$47  (via drill 0.61)
  Top 0.254: v-23.5,10.63 IC1.6 | v-43.82,10.63 -43.82,60.16 -45.09,61.43 -45.09,74.13 v-46.36,75.4 | v-43.82,75.4 v-43.82,91.91
  Bottom 0.254: v-23.5,10.63 v-43.82,10.63 | v-46.36,75.4 v-43.82,75.4 | v-43.82,91.91 -47.63,91.91 -48.9,93.18 -66.68,93.18 LED35.K
N$48  (via drill 0.61)
  Top 0.254: LED36.K v-83.19,98.26 | v-4.45,96.99 -3.18,95.72 -3.18,16.98 -15.88,4.28 -20.96,4.28 IC1.7
  Bottom 0.254: v-83.19,98.26 -70.49,98.26 -69.22,96.99 v-4.45,96.99
N$49  (via drill 0.61)
  Top 0.254: RN2.2 v-61.6,55.08 | v-18.42,52.54 -13.34,57.62 -13.34,79.21 -14.61,80.48 v-14.61,108.42
  Bottom 0.254: v-61.6,55.08 -59.06,52.54 v-18.42,52.54 | v-14.61,108.42 -22.23,116.04 -52.71,116.04 -53.98,114.77 -95.89,114.77 -98.43,112.23 -113.67,112.23 -114.94,110.96 -154.31,110.96 -156.85,108.42 -180.98,108.42 -193.68,95.72 -193.68,86.83 LED31.A
N$50  (via drill 0.61)
  Top 0.254: v-34.93,66.51 v-34.93,94.45
  Bottom 0.254: v-34.93,66.51 -57.79,66.51 -59.06,65.24 RN2.3 | v-34.93,94.45 LED32.A
N$51  (via drill 0.61)
  Top 0.254: v-56.52,47.46 RN2.4 | v-17.15,47.46 -13.34,47.46 v-13.34,46.19 | v-40.01,89.37 LED33.A
  Bottom 0.254: v-56.52,47.46 -50.17,47.46 -48.9,48.73 -19.69,48.73 -18.42,47.46 v-17.15,47.46 | v-13.34,46.19 -3.18,56.35 -3.18,89.37 v-40.01,89.37
N$52
  Top 0.254: RN2.5 -53.98,67.78 -55.25,69.05 -55.25,76.67 -53.98,77.94 -53.98,90.64 -55.25,91.91 LED34.A
N$53  (via drill 0.61)
  Top 0.254: v-51.44,60.16 RN2.6 | v-69.22,60.16 -69.22,93.18 LED35.A
  Bottom 0.254: v-51.44,60.16 v-69.22,60.16
N$54  (via drill 0.61)
  Top 0.254: LED36.A -84.46,95.72 -84.46,103.34 -75.57,103.34 -75.57,96.99 -74.3,95.72 -65.41,95.72 v-65.41,94.45 | v-60.33,94.45 v-57.79,91.91 | v-45.09,89.37 v-45.09,93.18 | v-18.42,93.18 -17.15,91.91 v-17.15,81.75 | v-46.36,69.05 -48.9,66.51 RN2.7
  Bottom 0.254: v-65.41,94.45 v-60.33,94.45 | v-57.79,91.91 -55.25,89.37 v-45.09,89.37 | v-45.09,93.18 v-18.42,93.18 | v-17.15,81.75 -15.88,80.48 -12.07,80.48 -10.8,79.21 -10.8,66.51 -12.07,65.24 -15.88,69.05 v-46.36,69.05
N$55  (via drill 0.61)
  Top 0.254: v-102.24,66.51 -102.24,93.18 LED37.A
  Bottom 0.254: v-102.24,66.51 -116.21,66.51 -117.48,65.24 RN4.2
N$56
  Top 0.254: LED38.A -116.21,90.64 -114.94,89.37 RN4.3
N$57  (via drill 0.61)
  Top 0.254: v-113.67,67.78 -113.67,66.51 -112.4,65.24 RN4.4 | v-126.37,67.78 -126.37,81.75 -130.18,85.56 -130.18,93.18 LED39.A
  Bottom 0.254: v-126.37,67.78 v-113.67,67.78
N$58  (via drill 0.61)
  Top 0.254: v-113.67,58.89 -109.86,62.7 RN4.5 | v-151.77,58.89 -151.77,89.37 LED40.A
  Bottom 0.254: v-113.67,58.89 v-151.77,58.89
N$59  (via drill 0.61)
  Top 0.254: v-107.32,70.32 RN4.6 | v-160.66,72.86 -160.66,93.18 LED41.A
  Bottom 0.254: v-107.32,70.32 -133.99,70.32 -135.26,71.59 -137.8,71.59 -139.07,72.86 v-160.66,72.86
N$60  (via drill 0.61)
  Top 0.254: v-104.78,75.4 RN4.7 | v-175.9,75.4 -175.9,93.18 LED42.A
  Bottom 0.254: v-104.78,75.4 -142.88,75.4 -144.15,76.67 -150.5,76.67 -151.77,75.4 v-175.9,75.4
N$61  (via drill 0.61)
  Top 0.254: v-114.94,90.64 -112.4,88.1 -112.4,74.13 -113.67,72.86 -113.67,70.32 v-111.13,67.78
  Bottom 0.254: LED43.A -188.6,90.64 v-114.94,90.64 | v-111.13,67.78 -102.24,67.78 -100.97,66.51 -100.97,65.24 -102.24,65.24 RN4.8
N$62  (via drill 0.61)
  Top 0.254: v-89.54,66.51 -89.54,94.45 -87,96.99 v-87,104.61
  Bottom 0.254: v-89.54,66.51 -98.43,66.51 -99.7,65.24 RN4.9 | v-87,104.61 -27.31,104.61 LED44.A
N$63  (via drill 0.61)
  Top 0.254: v-146.69,44.92 v-146.69,55.08 | v-140.34,50 v-140.34,44.92 | v-65.41,48.73 v-69.22,52.54 | v-31.12,50 v-26.04,44.92 | v-24.77,83.02 -29.85,88.1 -29.85,105.88 -36.2,112.23 -41.28,112.23 -41.28,103.34 LED45.A
  Bottom 0.254: v-146.69,55.08 -149.23,55.08 -153.04,58.89 -169.55,58.89 -173.36,62.7 RN6.2 | v-140.34,44.92 v-146.69,44.92 | v-140.34,50 -88.27,50 -85.73,52.54 v-69.22,52.54 | v-65.41,48.73 -50.17,48.73 -48.9,50 v-31.12,50 | v-26.04,44.92 -15.88,44.92 -4.45,56.35 -4.45,83.02 v-24.77,83.02
N$64  (via drill 0.61)
  Top 0.254: v-175.9,66.51 -178.44,69.05 -178.44,95.72 -173.36,100.8 v-173.36,103.34 | v-74.3,108.42 -71.76,110.96 -66.68,110.96 -66.68,104.61 -65.41,103.34 v-65.41,102.07
  Bottom 0.254: v-175.9,66.51 -172.09,66.51 -170.82,65.24 RN6.3 | v-173.36,103.34 -172.09,104.61 -153.04,104.61 -151.77,105.88 -114.94,105.88 -113.67,107.15 -89.54,107.15 -88.27,108.42 v-74.3,108.42 | v-65.41,102.07 LED46.A
N$65  (via drill 0.61)
  Top 0.254: v-168.28,96.99 RN6.4 | v-74.3,96.99 -70.49,100.8 LED47.A
  Bottom 0.254: v-74.3,96.99 v-168.28,96.99
N$66  (via drill 0.61)
  Top 0.254: v-164.47,77.94 -164.47,66.51 -165.74,65.24 RN6.5 | v-90.81,76.67 -90.81,94.45 -89.54,95.72 -89.54,104.61 -88.27,105.88 -85.73,105.88 LED48.A
  Bottom 0.254: v-164.47,77.94 -151.77,77.94 -150.5,79.21 -149.23,79.21 -147.96,77.94 -141.61,77.94 -140.34,76.67 v-90.81,76.67
N$67  (via drill 0.61)
  Top 0.254: v-163.2,72.86 RN6.6 | v-135.26,99.53 v-135.26,74.13 | LED49.A v-103.51,99.53
  Bottom 0.254: v-163.2,72.86 -161.93,74.13 v-135.26,74.13 | v-103.51,99.53 v-135.26,99.53
N$68  (via drill 0.61)
  Top 0.254: v-160.66,69.05 RN6.7 | v-117.48,69.05 -117.48,100.8 LED50.A
  Bottom 0.254: v-117.48,69.05 v-160.66,69.05
N$69  (via drill 0.61)
  Top 0.254: v-153.04,100.8 v-153.04,66.51
  Bottom 0.254: v-153.04,66.51 -156.85,66.51 -158.12,65.24 RN6.8 | v-153.04,100.8 -137.8,100.8 -136.53,102.07 LED51.A
N$70
  Top 0.254: LED52.A -153.04,102.07 -154.31,100.8 -154.31,66.51 -155.58,65.24 RN6.9
N$71  (via drill 0.61)
  Top 0.254: LED53.A -163.2,100.8 v-163.2,89.37 | v-126.37,89.37 -122.56,85.56 v-122.56,72.86
  Bottom 0.254: v-126.37,89.37 v-163.2,89.37 | v-122.56,72.86 -97.16,72.86 -95.89,74.13 -62.87,74.13 -61.6,72.86 RN8.2
N$72  (via drill 0.61)
  Top 0.254: v-15.88,67.78 -14.61,69.05 -14.61,75.4 -19.69,80.48 v-19.69,110.96
  Bottom 0.254: v-15.88,67.78 -56.52,67.78 -59.06,70.32 RN8.3 | v-19.69,110.96 -20.96,112.23 -95.89,112.23 -99.7,108.42 -113.67,108.42 -114.94,107.15 -155.58,107.15 -156.85,105.88 -173.36,105.88 LED54.A
N$73  (via drill 0.61)
  Top 0.254: RN8.4 -56.52,108.42 -64.14,116.04 v-98.43,116.04 | v-137.8,116.04 v-140.34,113.5 | v-145.42,113.5 v-146.69,112.23
  Bottom 0.254: v-98.43,116.04 v-137.8,116.04 | v-140.34,113.5 v-145.42,113.5 | v-146.69,112.23 -182.25,112.23 LED55.A
N$74  (via drill 0.61)
  Top 0.254: RN8.5 -53.98,75.4 -51.44,77.94 v-51.44,108.42
  Bottom 0.254: v-51.44,108.42 -26.04,108.42 LED56.A
N$75  (via drill 0.61)
  Top 0.254: v-50.17,58.89 -50.17,69.05 -51.44,70.32 RN8.6 | v-34.93,58.89 -31.12,58.89 -29.85,57.62 -27.31,57.62 -27.31,80.48 -33.66,86.83 -33.66,96.99 -34.93,98.26 -34.93,109.69 -36.2,110.96 -40.01,110.96 LED57.A
  Bottom 0.254: v-50.17,58.89 v-34.93,58.89
N$76  (via drill 0.61)
  Top 0.254: RN8.7 v-48.9,90.64 | v-52.71,90.64 -53.98,91.91 -53.98,107.15 -55.25,108.42 LED58.A
  Bottom 0.254: v-48.9,90.64 v-52.71,90.64
N$77  (via drill 0.61)
  Top 0.254: LED59.A -69.22,108.42 v-69.22,107.15 | v-65.41,107.15 -64.14,105.88 -64.14,89.37 v-65.41,88.1 | v-50.17,88.1 v-50.17,84.29 | v-47.63,84.29 -47.63,74.13 -46.36,72.86 RN8.8
  Bottom 0.254: v-65.41,107.15 v-69.22,107.15 | v-65.41,88.1 v-50.17,88.1 | v-50.17,84.29 v-47.63,84.29
N$78  (via drill 0.61)
  Top 0.254: v-47.63,107.15 -47.63,89.37 -46.36,88.1 -46.36,76.67 -43.82,74.13 RN8.9 | LED60.A v-81.92,105.88
  Bottom 0.254: v-47.63,107.15 -64.14,107.15 -65.41,105.88 v-81.92,105.88
N$79  (via drill 0.61)
  Top 0.254: v-94.62,19.52 IC3.15 | v-106.05,20.79 -108.59,23.33 v-108.59,27.14 | v-183.52,25.87 -183.52,43.65 -184.79,44.92 -184.79,70.32 LED7.K
  Bottom 0.254: v-94.62,19.52 -95.89,20.79 v-106.05,20.79 | v-108.59,27.14 -133.99,27.14 -135.26,25.87 v-183.52,25.87
N$80  (via drill 0.61)
  Top 0.254: IC3.1 -102.24,6.82 -102.24,4.28 -98.43,0.47 v-20.96,0.47 | v-15.88,5.55 -15.88,42.38 -12.07,46.19 v-12.07,66.51
  Bottom 0.254: v-15.88,5.55 v-20.96,0.47 | v-12.07,66.51 -12.07,79.21 LED8.K
N$81  (via drill 0.61)
  Top 0.254: v-94.62,42.38 -94.62,30.95 -95.89,29.68 -95.89,9.36 -94.62,8.09 IC3.2 | v-73.03,43.65 -71.76,44.92 -71.76,60.16 -70.49,61.43 v-70.49,69.05 | v-65.41,67.78 -65.41,86.83 -62.87,89.37 v-62.87,105.88 | v-46.36,105.88 -46.36,89.37 -45.09,88.1 v-45.09,84.29
  Bottom 0.254: v-94.62,42.38 -93.35,43.65 v-73.03,43.65 | v-70.49,69.05 -66.68,69.05 v-65.41,67.78 | v-62.87,105.88 v-46.36,105.88 | v-45.09,84.29 -33.66,84.29 -32.39,83.02 -32.39,79.21 LED9.K
N$82  (via drill 0.61)
  Top 0.254: v-93.35,19.52 -93.35,9.36 -92.08,8.09 IC3.3 | v-51.44,22.06 -50.17,23.33 -50.17,48.73 -52.71,51.27 -52.71,75.4 -50.17,77.94 v-50.17,79.21
  Bottom 0.254: v-93.35,19.52 -92.08,20.79 -85.73,20.79 -84.46,22.06 v-51.44,22.06 | v-50.17,79.21 LED10.K
N$83  (via drill 0.61)
  Top 0.254: v-89.54,55.08 -89.54,36.03 -90.81,34.76 -90.81,9.36 -89.54,8.09 IC3.4 | v-70.49,55.08 -70.49,57.62 -67.95,60.16 LED11.K
  Bottom 0.254: v-70.49,55.08 v-89.54,55.08
N$84
  Top 0.254: LED12.K -83.19,61.43 -84.46,61.43 -87,58.89 -87,28.41 -88.27,27.14 -88.27,9.36 -87,8.09 IC3.5
N$85  (via drill 0.61)
  Top 0.254: LED13.K v-98.43,70.32 | v-88.27,70.32 v-88.27,28.41 | v-83.19,27.14 -83.19,9.36 -84.46,8.09 IC3.6
  Bottom 0.254: v-98.43,70.32 v-88.27,70.32 | v-88.27,28.41 -87,27.14 v-83.19,27.14
N$86  (via drill 0.61)
  Top 0.254: v-111.13,79.21 -111.13,96.99 -108.59,99.53 -108.59,104.61 -102.24,110.96 -94.62,110.96 -94.62,74.13 -93.35,72.86 v-93.35,61.43 | v-81.92,61.43 -80.65,60.16 -80.65,9.36 -81.92,8.09 IC3.7
  Bottom 0.254: v-111.13,79.21 LED14.K | v-93.35,61.43 v-81.92,61.43
N$87  (via drill 0.61)
  Top 0.254: v-153.04,51.27 -153.04,18.25 -155.58,15.71 IC5.15
  Bottom 0.254: v-153.04,51.27 -154.31,52.54 -167.01,52.54 -173.36,58.89 -178.44,58.89 -193.68,74.13 -193.68,80.48 -130.18,80.48 LED15.K
N$88  (via drill 0.61)
  Top 0.254: v-150.5,10.63 -149.23,11.9 -149.23,42.38 -151.77,44.92 -151.77,57.62 -150.5,58.89 v-150.5,75.4 | LED16.K v-144.15,75.4
  Bottom 0.254: v-150.5,10.63 -155.58,10.63 -158.12,8.09 IC5.1 | v-144.15,75.4 v-150.5,75.4
N$89  (via drill 0.61)
  Top 0.254: LED17.K v-159.39,57.62 | v-155.58,53.81 -154.31,52.54 -154.31,19.52 -156.85,16.98 -156.85,9.36 -155.58,8.09 IC5.2
  Bottom 0.254: v-159.39,57.62 v-155.58,53.81
N$90  (via drill 0.61)
  Top 0.254: LED18.K v-174.63,9.36 | v-155.58,3.01 -153.04,5.55 IC5.3
  Bottom 0.254: v-174.63,9.36 -174.63,3.01 v-155.58,3.01
N$91  (via drill 0.61)
  Top 0.254: v-150.5,77.94 -149.23,76.67 -149.23,55.08 -150.5,53.81 -150.5,44.92 -146.69,41.11 -146.69,11.9 -150.5,8.09 IC5.4
  Bottom 0.254: LED19.K -187.33,76.67 -151.77,76.67 v-150.5,77.94
N$92  (via drill 0.61)
  Top 0.254: v-144.15,33.49 -144.15,11.9 -147.96,8.09 IC5.5 | v-155.58,34.76 -156.85,36.03 v-156.85,83.02 | v-120.02,83.02 -118.75,84.29 v-118.75,91.91 | v-81.92,91.91 -74.3,84.29 v-74.3,69.05 | v-65.41,66.51 v-65.41,56.35 | v-47.63,56.35 -46.36,55.08 v-46.36,44.92 | v-10.8,41.11 -4.45,47.46 v-4.45,84.29
  Bottom 0.254: v-144.15,33.49 -145.42,34.76 v-155.58,34.76 | v-120.02,83.02 v-156.85,83.02 | v-81.92,91.91 v-118.75,91.91 | v-74.3,69.05 -73.03,67.78 -66.68,67.78 v-65.41,66.51 | v-65.41,56.35 v-47.63,56.35 | v-46.36,44.92 -42.55,41.11 v-10.8,41.11 | v-4.45,84.29 -6.99,86.83 LED20.K
N$93  (via drill 0.61)
  Top 0.254: v-127.64,98.26 v-127.64,88.1 | v-33.66,98.26 -32.39,96.99 v-32.39,86.83
  Bottom 0.254: v-127.64,88.1 -163.2,88.1 -167.01,84.29 -198.76,84.29 -198.76,20.79 -188.6,10.63 -169.55,10.63 -168.28,11.9 -149.23,11.9 -145.42,8.09 IC5.6 | v-127.64,98.26 -84.46,98.26 -83.19,99.53 -70.49,99.53 -69.22,98.26 v-33.66,98.26 | v-32.39,86.83 LED21.K
N$94  (via drill 0.61)
  Top 0.254: v-102.24,36.03 v-102.24,11.9 | v-93.35,36.03 -92.08,37.3 v-92.08,41.11 | v-46.36,41.11 -45.09,42.38 v-45.09,56.35 | v-18.42,56.35 -17.15,57.62 -17.15,76.67 -20.96,80.48 v-20.96,88.1
  Bottom 0.254: v-102.24,11.9 -139.07,11.9 -142.88,8.09 IC5.7 | v-93.35,36.03 v-102.24,36.03 | v-46.36,41.11 v-92.08,41.11 | v-45.09,56.35 v-18.42,56.35 | v-20.96,88.1 -48.9,88.1 -50.17,86.83 LED22.K
N$95  (via drill 0.61)
  Top 0.254: LED23.K -66.68,85.56 v-66.68,61.43 | v-74.3,61.43 v-74.3,51.27 | v-70.49,51.27 -65.41,46.19 -65.41,38.57 -64.14,37.3 IC8.15
  Bottom 0.254: v-66.68,61.43 v-74.3,61.43 | v-74.3,51.27 v-70.49,51.27
N$96  (via drill 0.61)
  Top 0.254: v-70.49,47.46 -70.49,44.92 -71.76,43.65 -71.76,36.03 -69.22,33.49 -69.22,30.95 -66.68,28.41 IC8.1 | v-75.57,48.73 -79.38,48.73 -79.38,57.62 -75.57,61.43 -75.57,84.29 -80.65,89.37 -83.19,89.37 LED24.K
  Bottom 0.254: v-70.49,47.46 -71.76,48.73 v-75.57,48.73
N$97  (via drill 0.61)
  Top 0.254: LED25.K -98.43,81.75 -99.7,80.48 -99.7,67.78 -97.16,65.24 v-97.16,56.35 | v-64.14,57.62 -64.14,38.57 -62.87,37.3 -62.87,32.22 -64.14,30.95 IC8.2
  Bottom 0.254: v-97.16,56.35 -70.49,56.35 -69.22,57.62 v-64.14,57.62
N$98  (via drill 0.61)
  Top 0.254: v-113.67,83.02 LED26.K | v-81.92,83.02 -80.65,81.75 v-80.65,75.4 | v-64.14,75.4 -62.87,74.13 -62.87,39.84 -60.33,37.3 -60.33,29.68 -61.6,28.41 IC8.3
  Bottom 0.254: v-81.92,83.02 v-113.67,83.02 | v-80.65,75.4 v-64.14,75.4
N$99  (via drill 0.61)
  Top 0.254: v-182.25,88.1 -183.52,86.83 v-183.52,57.62 | v-161.93,51.27 -159.39,48.73 -159.39,32.22 -158.12,30.95 -158.12,18.25 -159.39,16.98 -159.39,4.28 -156.85,1.74 -113.67,1.74 -113.67,9.36 -104.78,9.36 v-104.78,30.95 | v-100.97,32.22 -99.7,33.49 v-99.7,37.3 | v-69.22,37.3 -65.41,37.3 v-65.41,32.22 | v-51.44,32.22 IC8.7
  Bottom 0.254: LED30.K -175.9,88.1 v-182.25,88.1 | v-183.52,57.62 -178.44,52.54 -168.28,52.54 -167.01,51.27 v-161.93,51.27 | v-104.78,30.95 -103.51,32.22 v-100.97,32.22 | v-69.22,37.3 v-99.7,37.3 | v-51.44,32.22 v-65.41,32.22
N$100  (via drill 0.61)
  Top 0.254: v-47.63,55.08 v-47.63,24.6 | v-10.8,81.75 -12.07,83.02 v-12.07,102.07 | v-151.77,104.61 -155.58,100.8 v-155.58,86.83
  Bottom 0.254: v-47.63,24.6 -52.71,24.6 -53.98,25.87 IC8.6 | v-47.63,55.08 -9.53,55.08 -5.72,58.89 -5.72,81.75 v-10.8,81.75 | v-12.07,102.07 -20.96,110.96 -56.52,110.96 -59.06,108.42 -73.03,108.42 -74.3,107.15 -88.27,107.15 -89.54,105.88 -113.67,105.88 -114.94,104.61 v-151.77,104.61 | v-155.58,86.83 LED29.K
N$101  (via drill 0.61)
  Top 0.254: IC8.5 -56.52,30.95 -55.25,32.22 v-55.25,38.57 | v-137.8,37.3 -137.8,57.62 -133.99,61.43 v-133.99,71.59 | v-137.8,72.86 v-137.8,85.56
  Bottom 0.254: v-55.25,38.57 -130.18,38.57 -131.45,37.3 v-137.8,37.3 | v-133.99,71.59 -135.26,72.86 v-137.8,72.86 | v-137.8,85.56 -139.07,86.83 LED28.K
N$102  (via drill 0.61)
  Top 0.254: v-73.03,29.68 -74.3,30.95 -74.3,44.92 -73.03,46.19 v-73.03,86.83
  Bottom 0.254: v-73.03,29.68 -60.33,29.68 -59.06,28.41 IC8.4 | v-73.03,86.83 -80.65,86.83 -81.92,88.1 -126.37,88.1 -127.64,86.83 LED27.K
N$103  (via drill 0.61)
  Top 0.254: v-31.12,102.07 -31.12,88.1 -26.04,83.02 -26.04,77.94 -24.77,76.67 -24.77,29.68 -23.5,28.41 IC7.6 | v-66.68,103.34 -67.95,104.61 LED59.K
  Bottom 0.254: v-31.12,102.07 -32.39,103.34 v-66.68,103.34
N$104  (via drill 0.61)
  Top 0.254: v-57.79,110.96 -42.55,110.96 -42.55,113.5 -41.28,114.77 -1.91,114.77 v-1.91,47.46
  Bottom 0.254: LED60.K -73.03,109.69 -71.76,110.96 v-57.79,110.96 | v-1.91,47.46 -20.96,28.41 IC7.7
N$105  (via drill 0.61)
  Top 0.254: v-170.82,99.53 -170.82,74.13 -172.09,72.86 -172.09,9.36 -173.36,8.09 IC6.7 | LED52.K v-144.15,99.53
  Bottom 0.254: v-144.15,99.53 v-170.82,99.53
N$106  (via drill 0.61)
  Top 0.254: v-186.06,9.36 IC6.15 | v-4.45,98.26 v-4.45,100.8 | v-18.42,107.15 v-17.15,108.42 | LED45.K v-37.47,105.88
  Bottom 0.254: v-186.06,9.36 -188.6,9.36 -200.03,20.79 -200.03,117.31 -20.96,117.31 v-4.45,100.8 | v-4.45,98.26 -13.34,107.15 -15.88,107.15 v-17.15,108.42 | v-18.42,107.15 -19.69,105.88 v-37.47,105.88
N$107  (via drill 0.61)
  Top 0.254: v-197.49,99.53 -197.49,16.98 -188.6,8.09 IC6.1 | v-99.7,114.77 -97.16,112.23 -90.81,112.23 v-90.81,95.72 | v-57.79,94.45 v-57.79,108.42 | v-53.98,108.42 -52.71,107.15 LED46.K
  Bottom 0.254: v-197.49,99.53 -183.52,113.5 -159.39,113.5 -158.12,114.77 v-99.7,114.77 | v-90.81,95.72 -60.33,95.72 -59.06,94.45 v-57.79,94.45 | v-57.79,108.42 v-53.98,108.42
N$108  (via drill 0.61)
  Top 0.254: v-186.06,67.78 -186.06,44.92 -184.79,43.65 -184.79,9.36 -186.06,8.09 IC6.2 | v-180.98,72.86 -179.71,74.13 v-179.71,81.75 | v-109.86,85.56 -107.32,88.1 v-107.32,102.07 | v-83.19,105.88 -81.92,104.61 -69.22,104.61 -69.22,103.34 LED47.K
  Bottom 0.254: v-180.98,72.86 v-186.06,67.78 | v-179.71,81.75 -178.44,83.02 -158.12,83.02 -156.85,84.29 -118.75,84.29 -117.48,85.56 v-109.86,85.56 | v-107.32,102.07 -106.05,103.34 -90.81,103.34 -88.27,105.88 v-83.19,105.88
N$109  (via drill 0.61)
  Top 0.254: v-177.17,53.81 -177.17,4.28 -182.25,4.28 -183.52,5.55 IC6.3 | v-170.82,55.08 -169.55,56.35 v-169.55,81.75 | v-88.27,81.75 -87,83.02 -87,88.1 -81.92,93.18 -81.92,100.8 LED48.K
  Bottom 0.254: v-177.17,53.81 -175.9,55.08 v-170.82,55.08 | v-169.55,81.75 -109.86,81.75 -108.59,80.48 -98.43,80.48 -97.16,81.75 v-88.27,81.75
N$110  (via drill 0.61)
  Top 0.254: v-179.71,102.07 -179.71,89.37 -182.25,86.83 -182.25,9.36 -180.98,8.09 IC6.4 | v-102.24,109.69 -98.43,105.88 LED49.K
  Bottom 0.254: v-179.71,102.07 -174.63,107.15 -156.85,107.15 -155.58,108.42 -114.94,108.42 -113.67,109.69 v-102.24,109.69
N$111  (via drill 0.61)
  Top 0.254: v-179.71,67.78 -179.71,9.36 -178.44,8.09 IC6.5 | v-165.74,100.8 v-165.74,72.86
  Bottom 0.254: v-179.71,67.78 -174.63,72.86 v-165.74,72.86 | v-165.74,100.8 -163.2,103.34 -114.94,103.34 LED50.K
N$112  (via drill 0.61)
  Top 0.254: v-167.01,98.26 -167.01,4.28 -174.63,4.28 -175.9,5.55 IC6.6 | LED51.K v-132.72,98.26
  Bottom 0.254: v-132.72,98.26 v-167.01,98.26
N$113  (via drill 0.61)
  Top 0.254: v-114.94,16.98 -113.67,16.98 -113.67,11.9 -108.59,11.9 -108.59,18.25 -111.13,20.79 v-111.13,32.22 | v-107.32,34.76 -107.32,60.16 -108.59,61.43 v-108.59,81.75 | v-100.97,81.75 -99.7,83.02 -99.7,93.18 LED37.K
  Bottom 0.254: v-114.94,16.98 -123.83,16.98 -125.1,15.71 IC4.15 | v-111.13,32.22 -108.59,34.76 v-107.32,34.76 | v-100.97,81.75 v-108.59,81.75
N$114  (via drill 0.61)
  Top 0.254: v-140.34,3.01 v-137.8,5.55 | v-184.79,1.74 -187.33,4.28 -187.33,20.79 -193.68,27.14 -193.68,95.72 -173.36,116.04 -142.88,116.04 -142.88,112.23 -135.26,104.61 -111.13,104.61 -111.13,98.26 -113.67,95.72 LED38.K
  Bottom 0.254: v-137.8,5.55 -127.64,5.55 IC4.1 | v-140.34,3.01 -141.61,1.74 v-184.79,1.74
N$115  (via drill 0.61)
  Top 0.254: LED39.K -130.18,95.72 -133.99,95.72 v-133.99,74.13 | v-131.45,71.59 -131.45,50 -133.99,47.46 -133.99,33.49 -130.18,29.68 -130.18,13.17 -125.1,8.09 IC4.2
  Bottom 0.254: v-133.99,74.13 v-131.45,71.59
N$116  (via drill 0.61)
  Top 0.254: LED40.K -144.15,89.37 -145.42,88.1 -145.42,70.32 -141.61,66.51 v-141.61,55.08 | v-136.53,55.08 -136.53,34.76 -131.45,29.68 v-131.45,10.63
  Bottom 0.254: v-141.61,55.08 v-136.53,55.08 | v-131.45,10.63 -130.18,9.36 -123.83,9.36 -122.56,8.09 IC4.3
N$117  (via drill 0.61)
  Top 0.254: LED41.K -160.66,95.72 -160.66,107.15 -164.47,110.96 -177.17,110.96 -177.17,109.69 -191.14,95.72 -191.14,61.43 -188.6,58.89 v-188.6,47.46 | v-132.72,36.03 -128.91,32.22 -122.56,32.22 -122.56,18.25 -121.29,16.98 -121.29,9.36 -120.02,8.09 IC4.4
  Bottom 0.254: v-188.6,47.46 -177.17,36.03 v-132.72,36.03
N$118  (via drill 0.61)
  Top 0.254: v-141.61,93.18 -139.07,90.64 -139.07,60.16 -140.34,58.89 v-140.34,57.62 | v-127.64,57.62 -126.37,56.35 -126.37,41.11 -121.29,36.03 -121.29,19.52 -118.75,16.98 -118.75,9.36 -117.48,8.09 IC4.5
  Bottom 0.254: LED42.K -173.36,93.18 v-141.61,93.18 | v-140.34,57.62 v-127.64,57.62
N$119  (via drill 0.61)
  Top 0.254: v-140.34,37.3 -133.99,30.95 -133.99,4.28 -116.21,4.28 -114.94,5.55 IC4.6 | v-187.33,47.46 -187.33,91.91 LED43.K
  Bottom 0.254: v-140.34,37.3 -141.61,38.57 -178.44,38.57 v-187.33,47.46
N$120  (via drill 0.61)
  Top 0.254: v-103.51,34.76 -103.51,4.28 -111.13,4.28 -112.4,5.55 IC4.7 | v-78.11,42.38 v-78.11,33.49 | v-61.6,42.38 -59.06,44.92 v-59.06,53.81 | v-8.26,53.81 -5.72,56.35 -5.72,102.07 -17.15,113.5 -23.5,113.5 -23.5,103.34 LED44.K
  Bottom 0.254: v-103.51,34.76 -85.73,34.76 -84.46,33.49 v-78.11,33.49 | v-61.6,42.38 v-78.11,42.38 | v-59.06,53.81 v-8.26,53.81
N$121  (via drill 0.61)
  Top 0.254: v-135.26,24.6 -136.53,25.87 G2.-
  Bottom 0.254: G2.- J1.2 | G1.+ v-135.26,24.6
N$122  (via drill 0.61)
  Top 0.254: v-123.83,30.95 -123.83,16.98 -122.56,15.71 IC4.14 | v-85.73,33.49 -81.92,29.68 v-81.92,28.41 | v-75.57,27.14 -71.76,23.33 v-71.76,10.63
  Bottom 0.254: v-123.83,30.95 -106.05,30.95 -103.51,33.49 v-85.73,33.49 | v-81.92,28.41 -80.65,27.14 v-75.57,27.14 | v-71.76,10.63 -60.33,10.63 -59.06,9.36 -22.23,9.36 -18.42,13.17 IC1.9
N$123  (via drill 0.61)
  Top 0.254: v-92.08,19.52 IC3.14 | v-51.44,20.79 -48.9,18.25 IC2.9
  Bottom 0.254: v-92.08,19.52 -85.73,19.52 -84.46,20.79 v-51.44,20.79
N$124  (via drill 0.61)
  Top 0.254: v-137.8,22.06 -137.8,18.25 -140.34,15.71 IC5.9 | v-64.14,23.33 -62.87,24.6 -62.87,30.95 -61.6,32.22 IC8.14
  Bottom 0.254: v-137.8,22.06 -85.73,22.06 -84.46,23.33 v-64.14,23.33
N$125  (via drill 0.61)
  Top 0.254: v-111.13,19.52 -109.86,18.25 IC4.9
  Bottom 0.254: v-111.13,19.52 -112.4,20.79 -178.44,20.79 -183.52,15.71 IC6.14
N$126  (via drill 0.61)
  Top 0.254: v-79.38,44.92 v-79.38,29.68
  Bottom 0.254: v-79.38,29.68 -127.64,29.68 -130.18,32.22 -137.8,32.22 -139.07,30.95 -179.71,30.95 -186.06,24.6 G2.+ | v-79.38,44.92 -71.76,44.92 -69.22,47.46 -57.79,47.46 -56.52,46.19 -50.17,46.19 -48.9,47.46 -19.69,47.46 -18.42,46.19 -17.15,46.19 -15.88,47.46 -15.88,48.73 -17.15,48.73 G3.-
N$127  (via drill 0.61)
  Top 0.254: v-170.82,27.14 IC6.9 | v-116.21,24.6 v-120.02,28.41 | v-100.97,24.6 -98.43,22.06 v-98.43,9.36 | v-75.57,8.09 v-78.11,10.63 | v-69.22,5.55 -65.41,1.74 -24.77,1.74 v-24.77,18.25 | v-28.58,20.79 -32.39,24.6 -32.39,32.22 -31.12,33.49 IC7.14
  Bottom 0.254: v-170.82,27.14 -135.26,27.14 -133.99,28.41 v-120.02,28.41 | v-100.97,24.6 v-116.21,24.6 | v-98.43,9.36 -87,9.36 -85.73,10.63 v-78.11,10.63 | v-75.57,8.09 -73.03,5.55 v-69.22,5.55 | v-24.77,18.25 -27.31,20.79 v-28.58,20.79
RESET
  Bottom 0.254: SV1.5 -161.93,46.19 -135.26,46.19 IC9.1
SCK  (via drill 0.61)
  Top 0.254: v-160.66,16.98 SV1.7 | IC8.11 -53.98,30.95 -55.25,29.68 -55.25,16.98 -53.98,15.71 IC2.11 | IC7.11 -23.5,30.95 -22.23,29.68 -22.23,16.98 -23.5,15.71 IC1.11 | v-109.86,51.27 -109.86,20.79 -107.32,18.25 -107.32,11.9 -108.59,10.63 -114.94,10.63 IC4.11 | IC5.11 -145.42,46.19 -142.88,48.73 v-142.88,61.43 | IC9.19 v-132.72,61.43
  Bottom 0.254: IC6.11 -175.9,15.71 -174.63,16.98 v-160.66,16.98 -146.69,16.98 -145.42,15.71 IC5.11 | -109.86,55.08 -100.97,55.08 -99.7,53.81 IC10.6 | -109.86,55.08 -131.45,55.08 -132.72,53.81 IC9.19 | -85.73,16.98 -113.67,16.98 -114.94,15.71 IC4.11 | -85.73,16.98 -84.46,15.71 IC3.11 | -55.25,16.98 -53.98,15.71 IC2.11 | -55.25,16.98 -85.73,16.98 | -55.25,16.98 -24.77,16.98 -23.5,15.71 IC1.11 | v-109.86,51.27 -109.86,55.08 | v-132.72,61.43 v-142.88,61.43
SENSOR_IN
  Bottom 0.254: IC9.7 -120.02,43.65 -121.29,42.38 -130.18,42.38 -131.45,41.11 -173.36,41.11 -178.44,46.19 IC11.OUT
SENSOR_PWR  (via drill 0.61)
  Top 0.254: v-113.67,42.38 -113.67,50 -112.4,51.27 IC9.11
  Bottom 0.254: v-113.67,42.38 -120.02,42.38 -121.29,41.11 -130.18,41.11 -131.45,39.84 -177.17,39.84 -183.52,46.19 IC11.IN
SPLIN  (via drill 0.61)
  Top 0.254: v-127.64,48.73 IC9.17
  Bottom 0.254: IC10.2 -102.24,46.19 -104.78,48.73 v-127.64,48.73 -164.47,48.73 -164.47,46.19 -167.01,46.19 SV1.1
SPLOUT  (via drill 0.61)
  Top 0.254: v-69.22,13.17 -67.95,11.9 -61.6,11.9 IC2.14 v-61.6,18.25 | v-33.66,18.25 -31.12,15.71 IC1.14 | v-151.77,42.38 -151.77,16.98 -153.04,15.71 IC5.14 | v-131.45,42.38 -131.45,47.46 -130.18,48.73 IC9.18 -130.18,56.35 v-126.37,60.16 | -98.43,55.08 -99.7,56.35 v-99.7,58.89 | -98.43,55.08 -97.16,53.81 IC10.5 | v-84.46,18.25 v-84.46,30.95 | v-95.89,30.95 -98.43,33.49 -98.43,55.08
  Bottom 0.254: v-69.22,13.17 -79.38,13.17 IC3.9 | v-33.66,18.25 v-61.6,18.25 v-84.46,18.25 | SV1.9 -154.31,44.92 v-151.77,42.38 v-131.45,42.38 | v-99.7,58.89 -100.97,60.16 v-126.37,60.16 | v-84.46,30.95 v-95.89,30.95
VCC  (via drill 0.61)
  Top 0.254: v-175.9,48.73 RN6.1 | RN5.1 -147.96,52.54 X1.1 | v-168.28,51.27 SV1.2 | v-173.36,47.46 IC6.10 | RN8.1 RN2.1 | IC8.16 -66.68,36.03 -70.49,36.03 -70.49,41.11 -67.95,43.65 G3.+ | v-60.33,66.51 v-60.33,46.19 | RN7.1 RN1.1 IC7.16 -36.2,30.95 -34.93,29.68 -34.93,20.79 -36.2,19.52 IC1.16 | v-55.25,42.38 -51.44,38.57 IC8.10 | IC10.3 -99.7,48.73 -102.24,51.27 IC10.7 | v-120.02,79.21 RN4.1 | v-93.35,77.94 -93.35,74.13 -92.08,72.86 RN3.1 | v-104.78,61.43 IC10.8 -104.78,51.27 -106.05,50 v-106.05,28.41 | v-112.4,23.33 IC4.10 | v-125.1,23.33 -127.64,20.79 IC4.16 | IC3.16 -97.16,22.06 v-98.43,23.33 -98.43,25.87 v-100.97,28.41 | v-141.61,50 -141.61,23.33 -142.88,22.06 IC5.10
  Bottom 0.254: -174.63,11.9 -187.33,11.9 -188.6,13.17 IC6.16 | -174.63,11.9 -173.36,13.17 IC6.10 | -174.63,11.9 -169.55,11.9 -168.28,13.17 -158.12,13.17 IC5.16 | v-175.9,48.73 -174.63,47.46 v-173.36,47.46 SV1.2 | -141.61,53.81 -142.88,53.81 -144.15,55.08 -145.42,55.08 -147.96,52.54 X1.1 -149.23,50 -167.01,50 v-168.28,51.27 | -141.61,53.81 -135.26,53.81 IC9.20 | R1.2 RN8.1 | v-60.33,66.51 -62.87,66.51 -64.14,65.24 RN2.1 | G3.+ -61.6,44.92 v-60.33,46.19 -56.52,42.38 v-55.25,42.38 | -37.47,32.22 -50.17,32.22 -51.44,33.49 IC8.10 | -37.47,32.22 -36.2,33.49 IC7.16 | -37.47,32.22 -22.23,32.22 -20.96,33.49 IC7.10 | IC10.8 -104.78,51.27 -102.24,51.27 IC10.7 | v-120.02,79.21 -118.75,80.48 -109.86,80.48 -108.59,79.21 -103.51,79.21 -102.24,77.94 v-93.35,77.94 | v-104.78,61.43 -94.62,61.43 -93.35,62.7 -92.08,62.7 RN3.1 | IC5.10 -142.88,15.71 -141.61,16.98 -128.91,16.98 -127.64,15.71 IC4.16 | v-125.1,23.33 v-112.4,23.33 v-98.43,23.33 | -83.19,11.9 -95.89,11.9 -97.16,13.17 IC3.16 | -83.19,11.9 -81.92,13.17 IC3.10 | -67.95,11.9 -66.68,13.17 IC2.16 | -67.95,11.9 -83.19,11.9 | -52.71,11.9 -51.44,13.17 IC2.10 | -52.71,11.9 -67.95,11.9 | -37.47,11.9 -36.2,13.17 IC1.16 | -37.47,11.9 -52.71,11.9 | -37.47,11.9 -22.23,11.9 -20.96,13.17 IC1.10 | v-100.97,28.41 v-106.05,28.41 | v-141.61,50 -141.61,53.81